# Altium project KontrollKast.PrjPcb
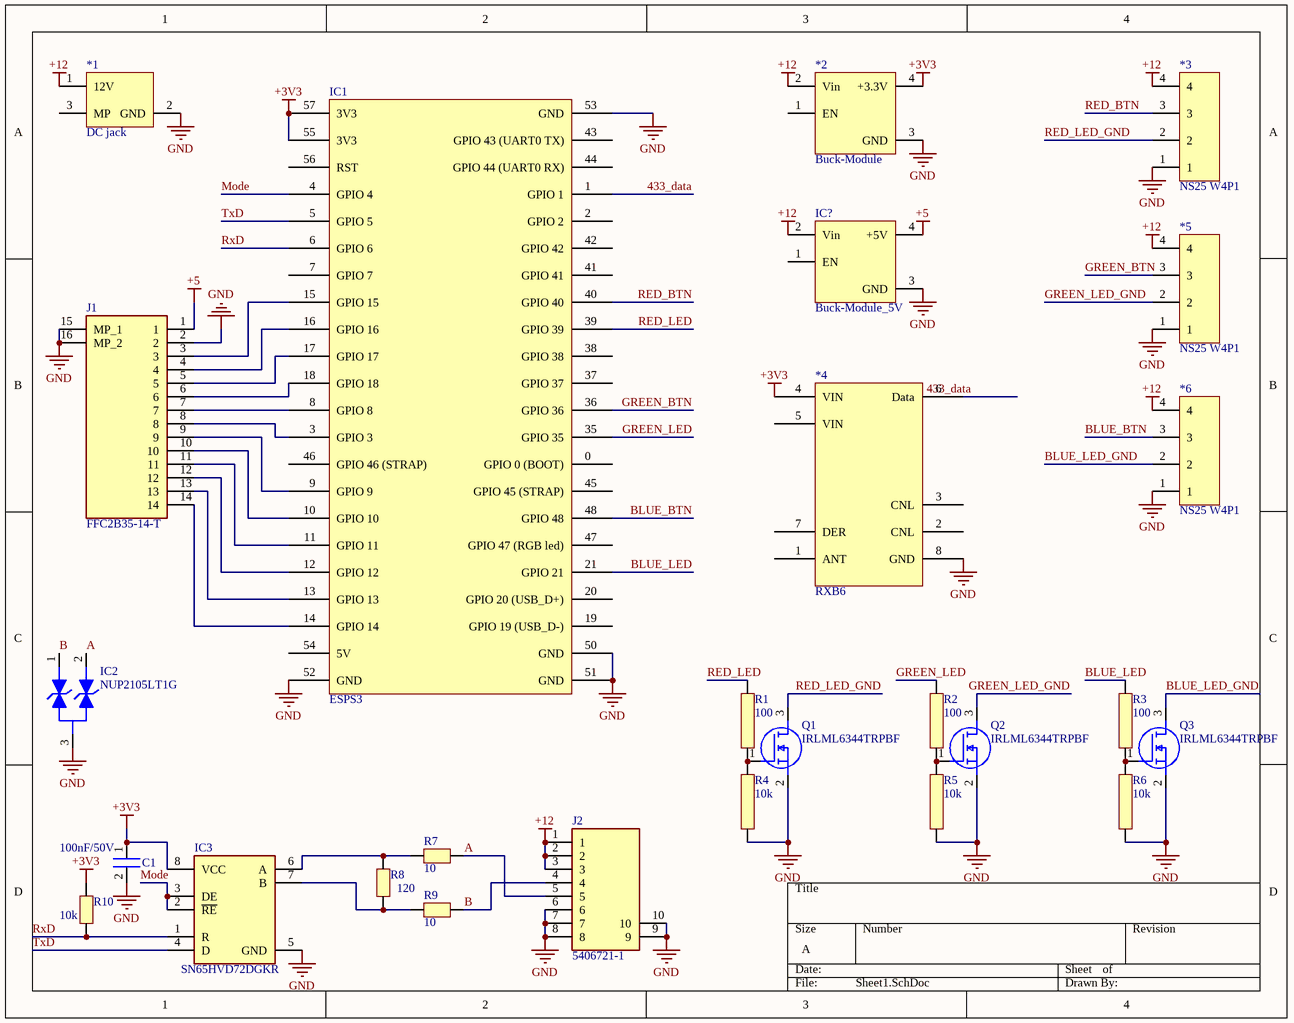
[diagram p0: Sheet1.SchDoc]
1 sheet, 26 parts. Net scope: global (net labels, ports and power ports of the same name join across sheets).
Board file: PCB2.PcbDoc

## Sheet Sheet1.SchDoc
size A; SheetNumber: 1; SheetTotal: 1

### Parts
*1  DC jack  [DC Jack]
*2  Buck-Module  [Buck-Module]
*3  NS25 W4P1  [NS25 W4P1]
*4  RXB6  [RXB6]
*5  NS25 W4P1  [NS25 W4P1]
*6  NS25 W4P1  [NS25 W4P1]
C1  100nF/50V  [Resistor]
IC1  ESPS3  [ESP32S3Module]
IC2  NUP2105LT1G  [SOT96P237X111-3N]
IC3  SN65HVD72DGKR  [SOP65P490X110-8N]
IC?  Buck-Module_5V  [Buck-Module]
J1  FFC2B35-14-T  [FFC2B3514T]
J2  5406721-1  [54067211]
Q1  IRLML6344TRPBF  [SOT95P237X112-3N]
Q2  IRLML6344TRPBF  [SOT95P237X112-3N]
Q3  IRLML6344TRPBF  [SOT95P237X112-3N]
R1  100  [Resistor]
R2  100  [Resistor]
R3  100  [Resistor]
R4  10k  [Resistor]
R5  10k  [Resistor]
R6  10k  [Resistor]
R7  10  [Resistor]
R8  120  [Resistor]
R9  10  [Resistor]
R10  10k  [Resistor]

### Nets
+3V3: *2.4(+3.3V) *4.4(VIN) C1.1 IC1.55(3V3) IC1.57(3V3) IC3.8(VCC) R10.2
+5: IC?.4(+5V) J1.1
+12: *1.1(12V) *2.2(Vin) *3.4 *5.4 *6.4 IC?.2(Vin) J2.1 J2.2 J2.3
GND: *1.2(GND) *2.3(GND) *3.1 *4.8(GND) *5.1 *6.1 C1.2 IC1.50(GND) IC1.51(GND) IC1.52(GND) IC1.53(GND) IC2.3 IC3.5(GND) IC?.3(GND) J1.2 J1.15(MP_1) J1.16(MP_2) J2.6 J2.7 J2.8 J2.9 J2.10 Q1.2(S) Q2.2(S) Q3.2(S) R4.1 R5.1 R6.1
433_data: *4.6(Data) IC1.1(GPIO_1)
A: IC2.2 J2.5 R7.2
B: IC2.1 J2.4 R9.2
BLUE_BTN: *6.3 IC1.48(GPIO_48)
BLUE_LED: IC1.21(GPIO_21) R3.2
BLUE_LED_GND: *6.2 Q3.3(D)
GREEN_BTN: *5.3 IC1.36(GPIO_36)
GREEN_LED: IC1.35(GPIO_35) R2.2
GREEN_LED_GND: *5.2 Q2.3(D)
Mode: IC1.4(GPIO_4) IC3.2(~{RE}) IC3.3(DE)
RED_BTN: *3.3 IC1.40(GPIO_40)
RED_LED: IC1.39(GPIO_39) R1.2
RED_LED_GND: *3.2 Q1.3(D)
RxD: IC1.6(GPIO_6) IC3.1(R) R10.1
TxD: IC1.5(GPIO_5) IC3.4(D)
NetIC1_3: IC1.3(GPIO_3) J1.8
NetIC1_8: IC1.8(GPIO_8) J1.7
NetIC1_9: IC1.9(GPIO_9) J1.9
NetIC1_10: IC1.10(GPIO_10) J1.10
NetIC1_11: IC1.11(GPIO_11) J1.11
NetIC1_12: IC1.12(GPIO_12) J1.12
NetIC1_13: IC1.13(GPIO_13) J1.13
NetIC1_14: IC1.14(GPIO_14) J1.14
NetIC1_15: IC1.15(GPIO_15) J1.3
NetIC1_16: IC1.16(GPIO_16) J1.4
NetIC1_17: IC1.17(GPIO_17) J1.5
NetIC1_18: IC1.18(GPIO_18) J1.6
NetIC3_6: IC3.6(A) R7.1 R8.2
NetIC3_7: IC3.7(B) R8.1 R9.1
NetQ1_1: Q1.1(G) R1.1 R4.2
NetQ2_1: Q2.1(G) R2.1 R5.2
NetQ3_1: Q3.1(G) R3.1 R6.2

Not connected (* = marked no-connect by the designer): *1 3(MP); *2 1(EN); *4 1(ANT) 2(CNL) 3(CNL) 5(VIN) 7(DER); IC1 0(GPIO_0_(BOOT)) 2(GPIO_2) 7(GPIO_7) 19(GPIO_19_(USB_D-)) 20(GPIO_20_(USB_D+)) 37(GPIO_37) 38(GPIO_38) 41(GPIO_41) 42(GPIO_42) 43(GPIO_43_(UART0_TX)) 44(GPIO_44_(UART0_RX)) 45(GPIO_45_(STRAP)) 46(GPIO_46_(STRAP)) 47(GPIO_47_(RGB_led)) 54(5V) 56(RST); IC? 1(EN)

### Library data of the parts
C1 = 0603 cap
IC2 = NUP2105LT1G: Integrated Circuit; Manufacturer_Name: onsemi; Datasheet Link: https://www.onsemi.com/pub/Collateral/NUP2105L-D.PDF; Height: 1.11mm; Manufacturer_Part_Number: NUP2105LT1G; Mouser Part Number: 863-NUP2105LT1G; Mouser Price/Stock: https://www.mouser.co.uk/ProductDetail/onsemi/NUP2105LT1G?qs=ZXBb0xZ9WeDHmiHN%252BYKtYA%3D%3D; Arrow Part Number: NUP2105LT1G; Arrow Price/Stock: https://www.arrow.com/en/products/nup2105lt1g/on-semiconductor?utm_currency=USD&region=europe
IC3 = SN65HVD3085EDGKRG4: Integrated Circuit; Manufacturer_Name: Texas Instruments; Datasheet Link: http://www.ti.com/lit/ds/symlink/sn65hvd3082e.pdf; Height: 1.1mm; Manufacturer_Part_Number: SN65HVD3085EDGKRG4
J1 = FFC2B35-14-T: Connector; Manufacturer_Name: GCT (GLOBAL CONNECTOR TECHNOLOGY); Datasheet Link: https://gct.co/files/drawings/ffc2b35.pdf; Height: 2.2mm; Manufacturer_Part_Number: FFC2B35-14-T; Mouser Part Number: 640-FFC2B35-14-T; Mouser Price/Stock: https://www.mouser.co.uk/ProductDetail/GCT/FFC2B35-14-T?qs=Li%252BoUPsLEnvGh4quluOFdA%3D%3D
J2 = 5406721-1: Connector; Manufacturer_Name: TE Connectivity; Datasheet Link: https://www.te.com/commerce/DocumentDelivery/DDEController?Action=srchrtrv&DocNm=82066_Mod_Jacks_and_MRJ21_Prod_-_Single&DocType=Catalog%20Section&DocLang=English&PartCntxt=5406721-1&DocFormat=pdf; Height: 12mm; Manufacturer_Part_Number: 5406721-1; Mouser Part Number: 571-5406721-1; Mouser Price/Stock: https://www.mouser.co.uk/ProductDetail/TE-Connectivity-AMP/5406721-1?qs=dJbzCyn%252BCFbR42PHIn9ZjQ%3D%3D; Arrow Part Number: 5406721-1; Arrow Price/Stock: https://www.arrow.com/en/products/5406721-1/te-connectivity?region=nac
Q1-Q3 = IRLML6344TRPBF: MOSFET (N-Channel); Manufacturer_Name: Infineon; Datasheet Link: https://www.infineon.com/dgdl/irlml6344pbf.pdf?fileId=5546d462533600a4015356689c44262c; Height: 1.12mm; Manufacturer_Part_Number: IRLML6344TRPBF; Mouser Part Number: 942-IRLML6344TRPBF; Mouser Price/Stock: https://www.mouser.co.uk/ProductDetail/Infineon-Technologies/IRLML6344TRPBF?qs=9%252BKlkBgLFf2w4qS48UOXVw%3D%3D; Arrow Part Number: IRLML6344TRPBF; Arrow Price/Stock: https://www.arrow.com/en/products/irlml6344trpbf/infineon-technologies-ag?utm_currency=USD&region=europe
R1-R10 = Resistor